# Altium schematic sheet HARNESS.SchDoc: HARNESS
size 558 x 401 mm; Organization: Carnegie Institution of Washington; DocumentNumber: 4; SheetNumber: 4; SheetTotal: 8; DrawnBy: A. BAGISH; Engineer: A. BAGISH; PageSetup: Record=PageOptions|CenterHorizontal=True|CenterVertical=True|PrintScale=1.12|XCorrection=1.00|YCorrection=1.00|PrintKind=0|BorderSize=5000000|LeftOffset=0|BottomOffset=0|Orientation=2|PaperLength=1000|PaperWidth=1000|Scale=100|PaperSource=15|PrintQuality=1200|MediaType=1|DitherType=10|PaperKind=11 x 17|PrintScaleMode=1; DocumentName: HARNESS
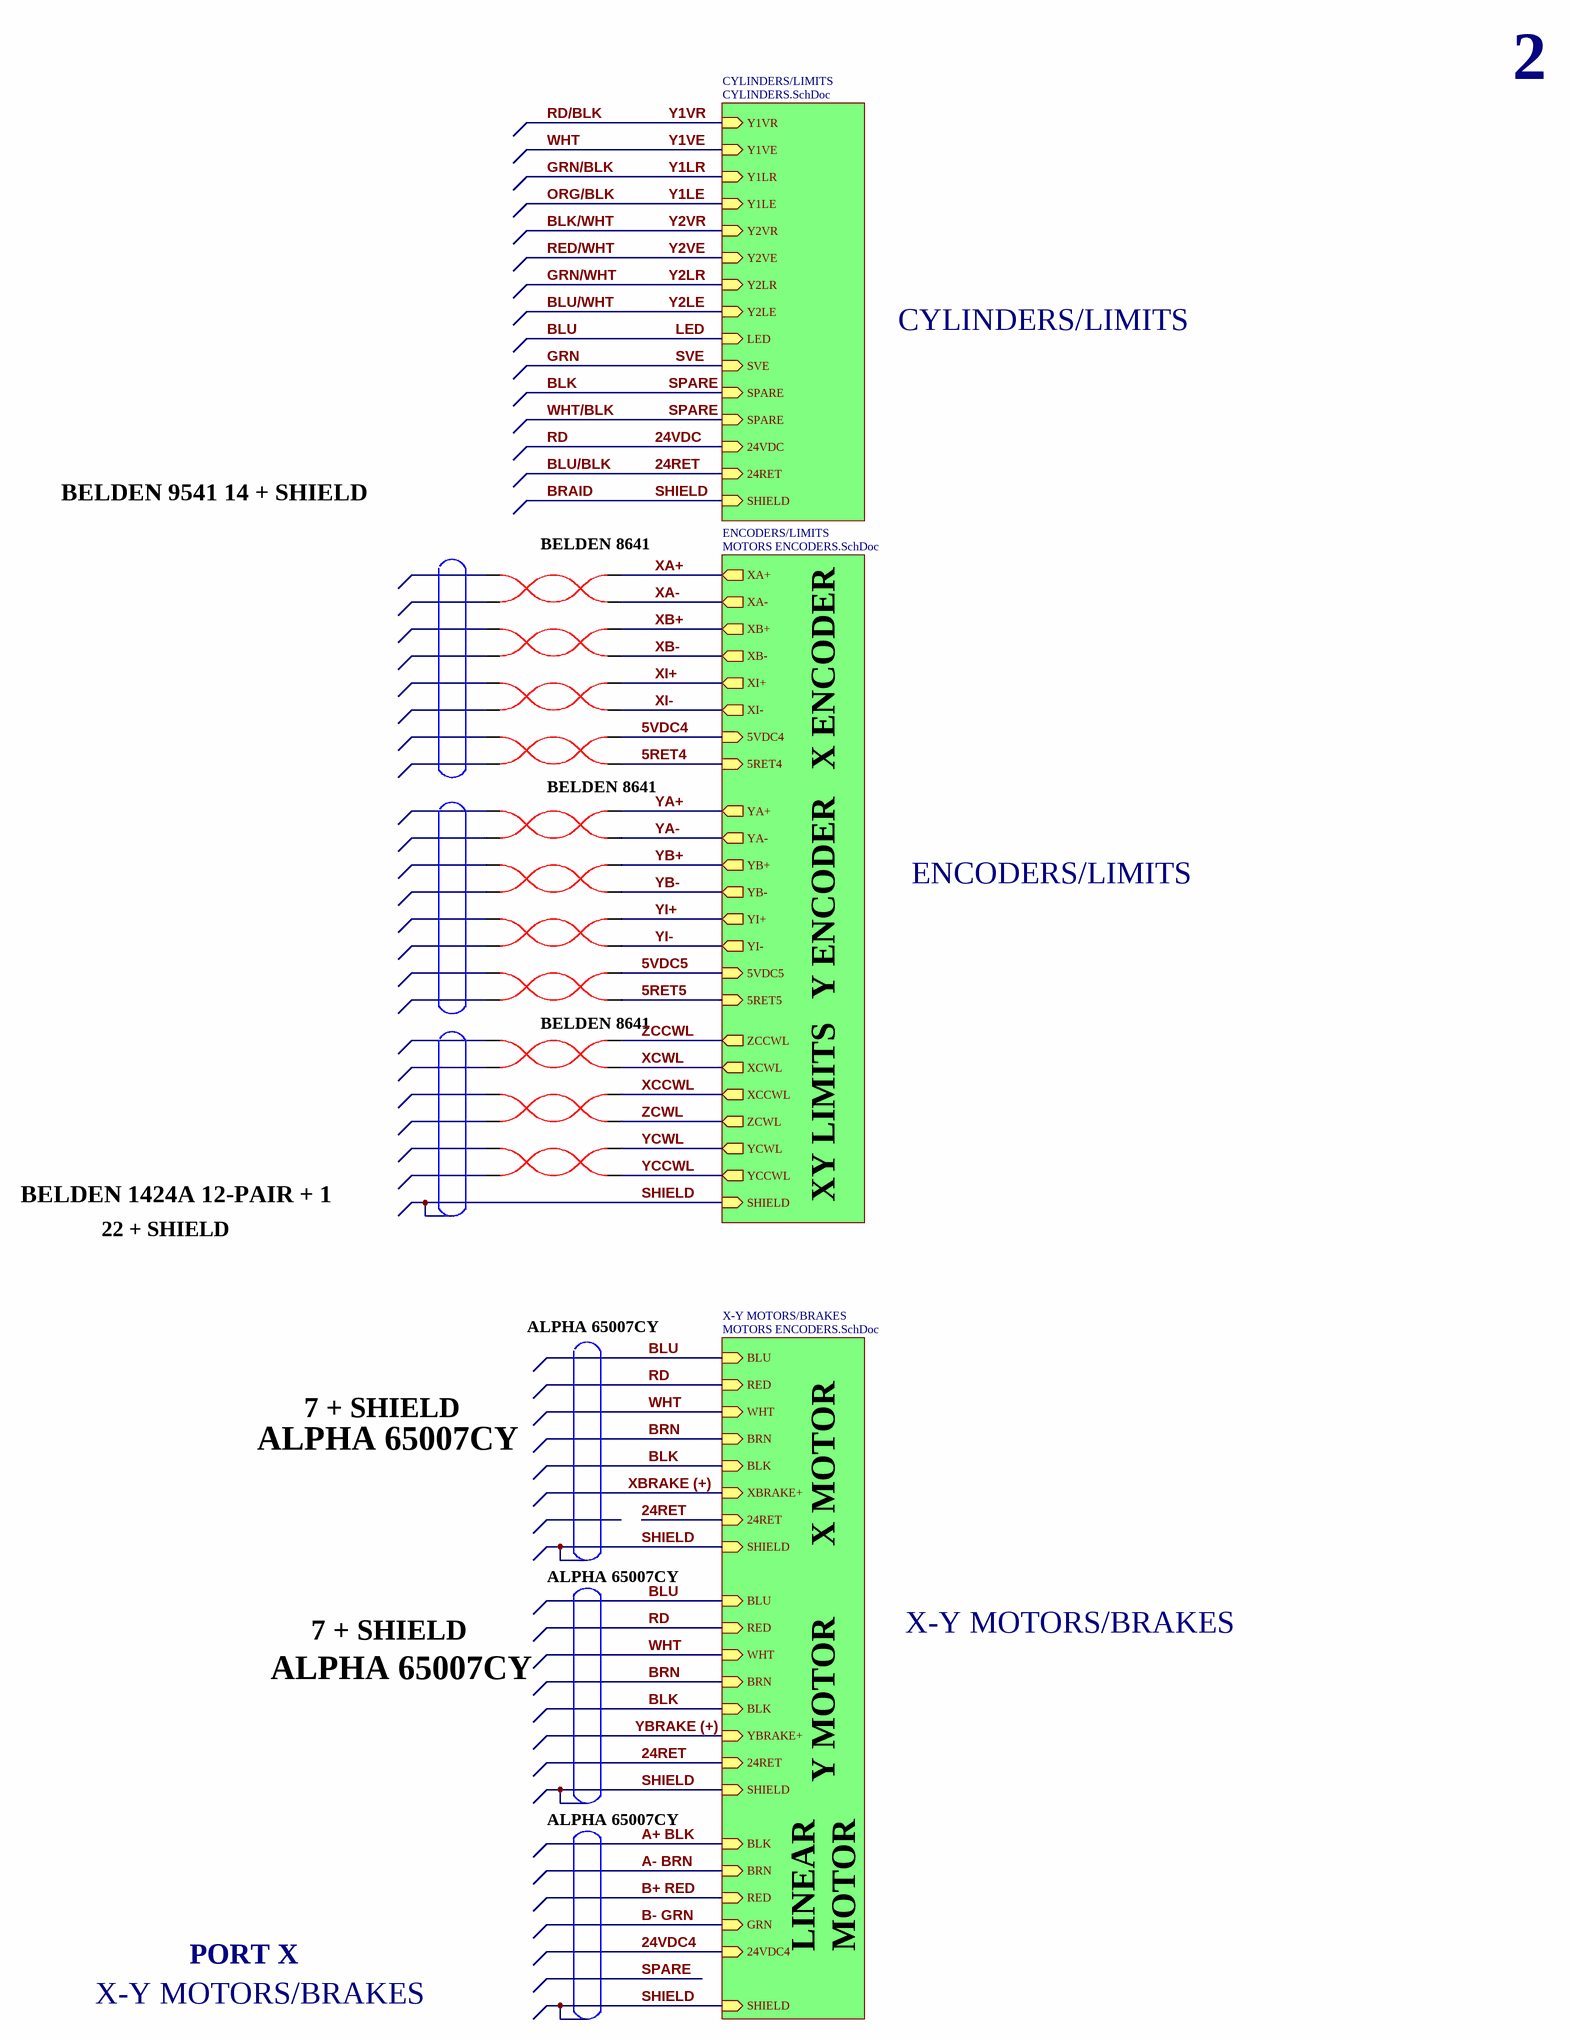
[diagram p0: HARNESS.SchDoc]

## Parts
(Parts that share a designator on the sheet are numbered #1, #2 ... from top to bottom, then left to right.)
?#1  (no value)
?#2  (no value)
?#3  (no value)
?#4  (no value)
?#5  (no value)
?#6  (no value)
?#7  (no value)
?#8  (no value)
?#9  (no value)
?#10  (no value)
?#11  (no value)

## Sub-sheets
CYLINDERS/LIMITS = CYLINDERS.SchDoc: Y1VR (in), Y1VE (in), Y1LR (in), Y1LE (in), Y2VR (in), Y2VE (in), Y2LR (in), Y2LE (in), LED (in), SVE (in), SPARE (in), SPARE (in), 24VDC (in), 24RET (in), SHIELD (in)
ENCODERS/LIMITS = MOTORS ENCODERS.SchDoc: XA+, XA-, XB+, XB-, XI+, XI-, YA+, YA-, YB+, YB-, YI+, YI-, ZCCWL, XCWL, XCCWL, ZCWL, YCWL, YCCWL, 5VDC4, 5RET4, 5VDC5, 5RET5, SHIELD
X-Y MOTORS/BRAKES = MOTORS ENCODERS.SchDoc: BLU, RED, WHT, BRN, BLK, XBRAKE+, 24RET, SHIELD, BLK, BRN, RED, GRN, SHIELD, BLU, RED, WHT, BRN, BLK, YBRAKE+, 24RET, SHIELD, 24VDC4

## Nets
5RET4: ?#4.2 ; sheet ENCODERS/LIMITS/5RET4
5RET5: ?#8.2 ; sheet ENCODERS/LIMITS/5RET5
5VDC4: ?#4.1 ; sheet ENCODERS/LIMITS/5VDC4
5VDC5: ?#8.1 ; sheet ENCODERS/LIMITS/5VDC5
24RET: sheet CYLINDERS/LIMITS/24RET, sheet X-Y MOTORS/BRAKES/24RET, sheet X-Y MOTORS/BRAKES/24RET  [also labelled BLU/BLK]
24VDC: sheet CYLINDERS/LIMITS/24VDC, sheet X-Y MOTORS/BRAKES/RED, sheet X-Y MOTORS/BRAKES/RED  [also labelled RD]
24VDC4: sheet X-Y MOTORS/BRAKES/24VDC4
A+ BLK: sheet X-Y MOTORS/BRAKES/BLK
A- BRN: sheet X-Y MOTORS/BRAKES/BRN
B+ RED: sheet X-Y MOTORS/BRAKES/RED
B- GRN: sheet X-Y MOTORS/BRAKES/GRN
BLK: sheet CYLINDERS/LIMITS/SPARE, sheet CYLINDERS/LIMITS/SPARE, sheet X-Y MOTORS/BRAKES/BLK, sheet X-Y MOTORS/BRAKES/BLK  [also labelled SPARE, WHT/BLK]
BLK/WHT: sheet CYLINDERS/LIMITS/Y2VR  [also labelled Y2VR]
BLU: sheet CYLINDERS/LIMITS/LED, sheet X-Y MOTORS/BRAKES/BLU, sheet X-Y MOTORS/BRAKES/BLU  [also labelled LED]
BLU/WHT: sheet CYLINDERS/LIMITS/Y2LE  [also labelled Y2LE]
BRAID: sheet CYLINDERS/LIMITS/SHIELD, sheet ENCODERS/LIMITS/SHIELD, sheet X-Y MOTORS/BRAKES/SHIELD, sheet X-Y MOTORS/BRAKES/SHIELD, sheet X-Y MOTORS/BRAKES/SHIELD  [also labelled SHIELD]
BRN: sheet X-Y MOTORS/BRAKES/BRN, sheet X-Y MOTORS/BRAKES/BRN
GRN: sheet CYLINDERS/LIMITS/SVE  [also labelled SVE]
GRN/BLK: sheet CYLINDERS/LIMITS/Y1LR  [also labelled Y1LR]
GRN/WHT: sheet CYLINDERS/LIMITS/Y2LR  [also labelled Y2LR]
ORG/BLK: sheet CYLINDERS/LIMITS/Y1LE  [also labelled Y1LE]
RD/BLK: sheet CYLINDERS/LIMITS/Y1VR  [also labelled Y1VR]
RED/WHT: sheet CYLINDERS/LIMITS/Y2VE  [also labelled Y2VE]
WHT: sheet CYLINDERS/LIMITS/Y1VE, sheet X-Y MOTORS/BRAKES/WHT, sheet X-Y MOTORS/BRAKES/WHT  [also labelled Y1VE]
XA+: ?#1.1 ; sheet ENCODERS/LIMITS/XA+
XA-: ?#1.2 ; sheet ENCODERS/LIMITS/XA-
XB+: ?#2.1 ; sheet ENCODERS/LIMITS/XB+
XB-: ?#2.2 ; sheet ENCODERS/LIMITS/XB-
XBRAKE (+): sheet X-Y MOTORS/BRAKES/XBRAKE+
XCCWL: ?#10.1 ; sheet ENCODERS/LIMITS/XCCWL
XCWL: ?#9.2 ; sheet ENCODERS/LIMITS/XCWL
XI+: ?#3.1 ; sheet ENCODERS/LIMITS/XI+
XI-: ?#3.2 ; sheet ENCODERS/LIMITS/XI-
YA+: ?#5.1 ; sheet ENCODERS/LIMITS/YA+
YA-: ?#5.2 ; sheet ENCODERS/LIMITS/YA-
YB+: ?#6.1 ; sheet ENCODERS/LIMITS/YB+
YB-: ?#6.2 ; sheet ENCODERS/LIMITS/YB-
YBRAKE (+): sheet X-Y MOTORS/BRAKES/YBRAKE+
YCCWL: ?#11.2 ; sheet ENCODERS/LIMITS/YCCWL
YCWL: ?#11.1 ; sheet ENCODERS/LIMITS/YCWL
YI+: ?#7.1 ; sheet ENCODERS/LIMITS/YI+
YI-: ?#7.2 ; sheet ENCODERS/LIMITS/YI-
ZCCWL: ?#9.1 ; sheet ENCODERS/LIMITS/ZCCWL
ZCWL: ?#10.2 ; sheet ENCODERS/LIMITS/ZCWL

Not connected (* = marked no-connect by the designer): ?#1 3 4; ?#2 3 4; ?#3 3 4; ?#4 3 4; ?#5 3 4; ?#6 3 4; ?#7 3 4; ?#8 3 4; ?#9 3 4; ?#10 3 4; ?#11 3 4

## Notes on the sheet
- 2
- CYLINDERS/LIMITS
- BELDEN 9541 14 + SHIELD
- BELDEN 8641
- X ENCODER
- ENCODERS/LIMITS
- Y ENCODER
- BELDEN 1424A 12-PAIR + 1
- 22 + SHIELD
- XY LIMITS
- ALPHA 65007CY
- 7 + SHIELD
- X MOTOR
- X-Y MOTORS/BRAKES
- Y MOTOR
- PORT X
- LINEAR
- MOTOR
- Carnegie Institution of Washington
- 813 Santa Barbara Street
- The Observatories
- PHONE (626) 577-1122               FAX (626) 795-8136
- Pasadena, California 91101
- Title:
- OCIW
- Size:
- Date:
- C
- Scale:
- Drawn By:
- Checked By:
- A. BAGISH
- alanb
- Revision:
- Sheet          of
- File:

## Library data of the parts
?#1-?#11 = TP2